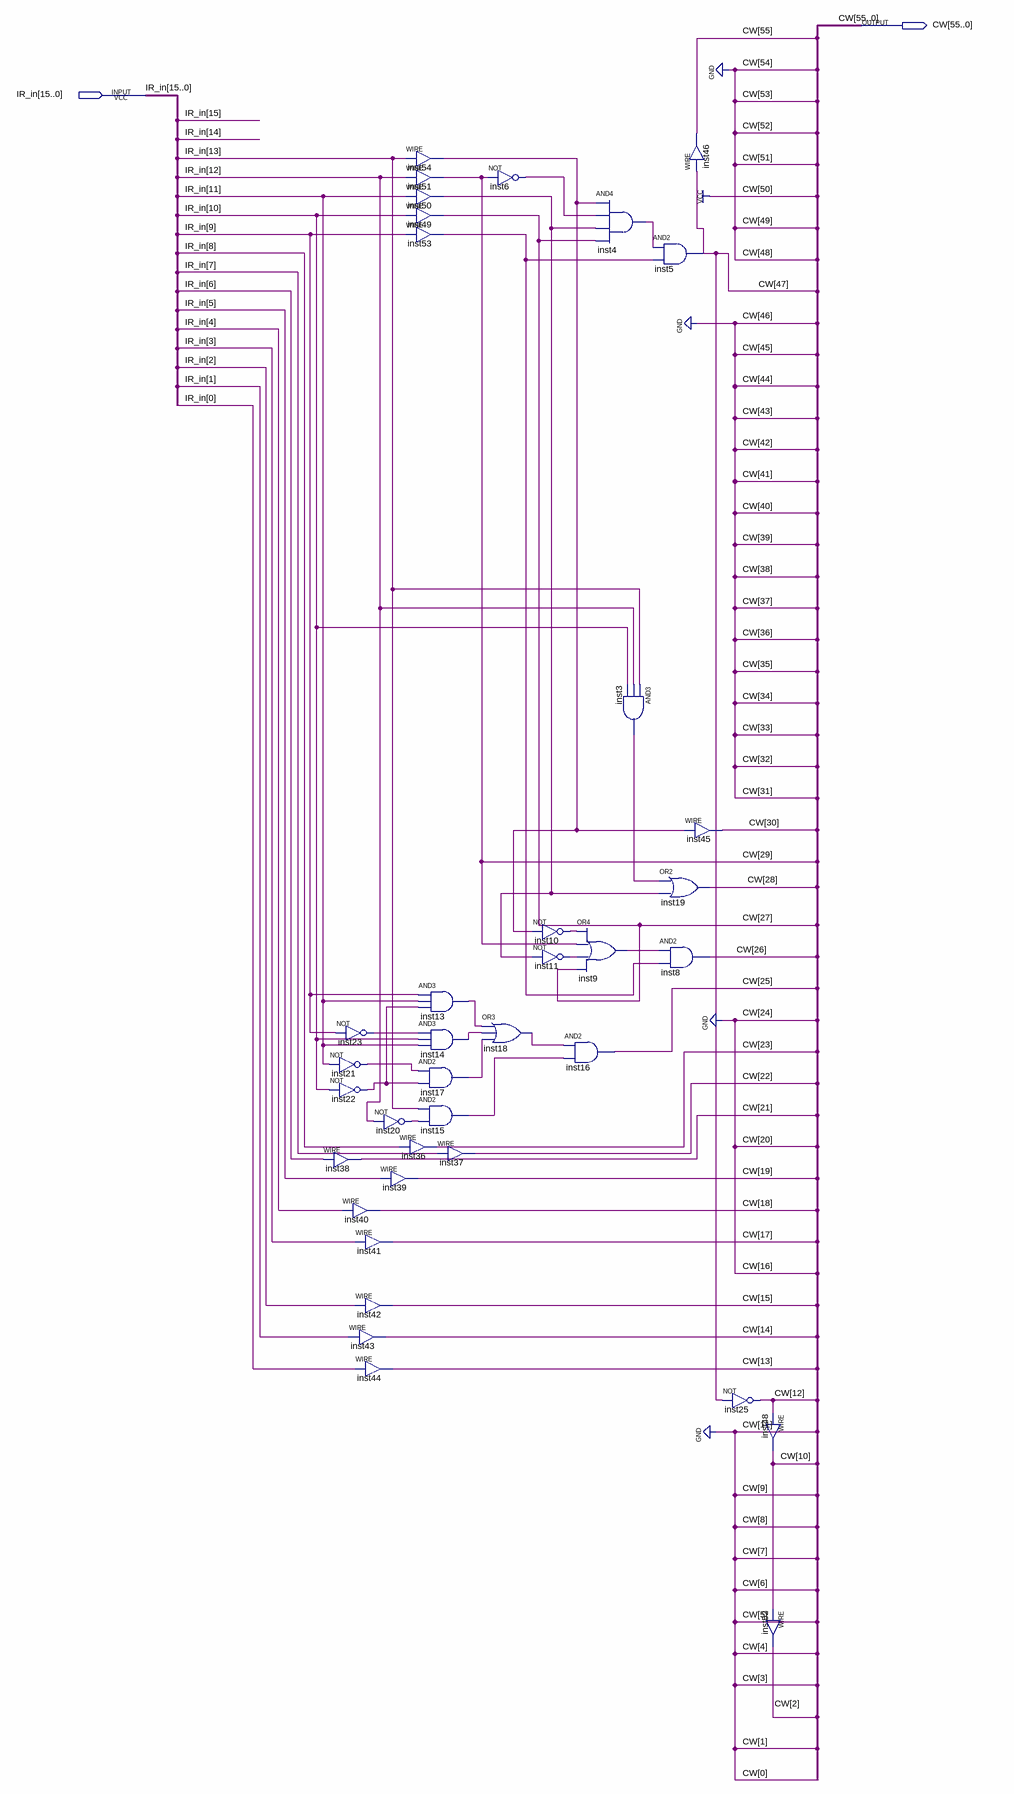
[diagram p0: schematic sheet]
// Quartus schematic Execute0_01.bdf as structural Verilog: 38 symbols, 2 pins
module Execute0_01 (
  input  [15:0] IR_in,
  output [55:0] CW
);

  wire inst3_out, inst4_out, inst6_out, inst9_out, inst10_out, inst11_out, inst13_out, inst14_out,
       inst15_out, inst17_out, inst18_out, inst20_out, inst21_out, inst22_out, inst23_out, inst50_out,
       inst53_out, inst54_out;

  not inst23 (inst23_out, IR_in[9]);
  not inst21 (inst21_out, IR_in[11]);
  not inst22 (inst22_out, IR_in[10]);
  assign CW[21] = IR_in[6];  // WIRE inst38
  assign CW[18] = IR_in[4];  // WIRE inst40
  assign CW[17] = IR_in[3];  // WIRE inst41
  assign CW[15] = IR_in[2];  // WIRE inst42
  assign CW[14] = IR_in[1];  // WIRE inst43
  assign CW[13] = IR_in[0];  // WIRE inst44
  assign inst54_out = IR_in[13];  // WIRE inst54
  assign CW[29] = IR_in[12];  // WIRE inst51
  assign inst50_out = IR_in[11];  // WIRE inst50
  assign CW[27] = IR_in[10];  // WIRE inst49
  assign inst53_out = IR_in[9];  // WIRE inst53
  not inst20 (inst20_out, IR_in[12]);
  assign CW[23] = IR_in[8];  // WIRE inst36
  assign CW[19] = IR_in[5];  // WIRE inst39
  and inst13 (inst13_out, IR_in[9], IR_in[11], inst22_out);
  and inst14 (inst14_out, inst23_out, IR_in[10], IR_in[11]);
  and inst17 (inst17_out, inst21_out, inst22_out);
  and inst15 (inst15_out, IR_in[13], inst20_out);
  assign CW[22] = IR_in[7];  // WIRE inst37
  not inst6 (inst6_out, CW[29]);
  or inst18 (inst18_out, inst13_out, inst14_out, inst17_out);
  not inst10 (inst10_out, inst54_out);
  not inst11 (inst11_out, inst50_out);
  and inst16 (CW[25], inst18_out, inst15_out);
  and inst4 (inst4_out, inst54_out, inst6_out, inst50_out, CW[27]);
  and inst3 (inst3_out, IR_in[13], IR_in[12], IR_in[10]);
  or inst9 (inst9_out, inst10_out, CW[29], inst11_out, CW[27]);
  and inst5 (CW[47], inst4_out, inst53_out);
  or inst19 (CW[28], inst3_out, inst50_out);
  and inst8 (CW[26], inst9_out, inst53_out);
  assign CW[55] = CW[47];  // WIRE inst46
  assign CW[30] = inst54_out;  // WIRE inst45
  not inst25 (CW[12], CW[47]);
  assign CW[10] = CW[12];  // WIRE inst48
  assign CW[2] = CW[10];  // WIRE inst52

  assign {CW[54:48], CW[46:31], CW[24], CW[20], CW[16], CW[11], CW[9:3], CW[1:0]} = 36'b000010000000000000000000000000000000;
endmodule
